# Altium schematic sheet atWork_Main.SchDoc
size A3
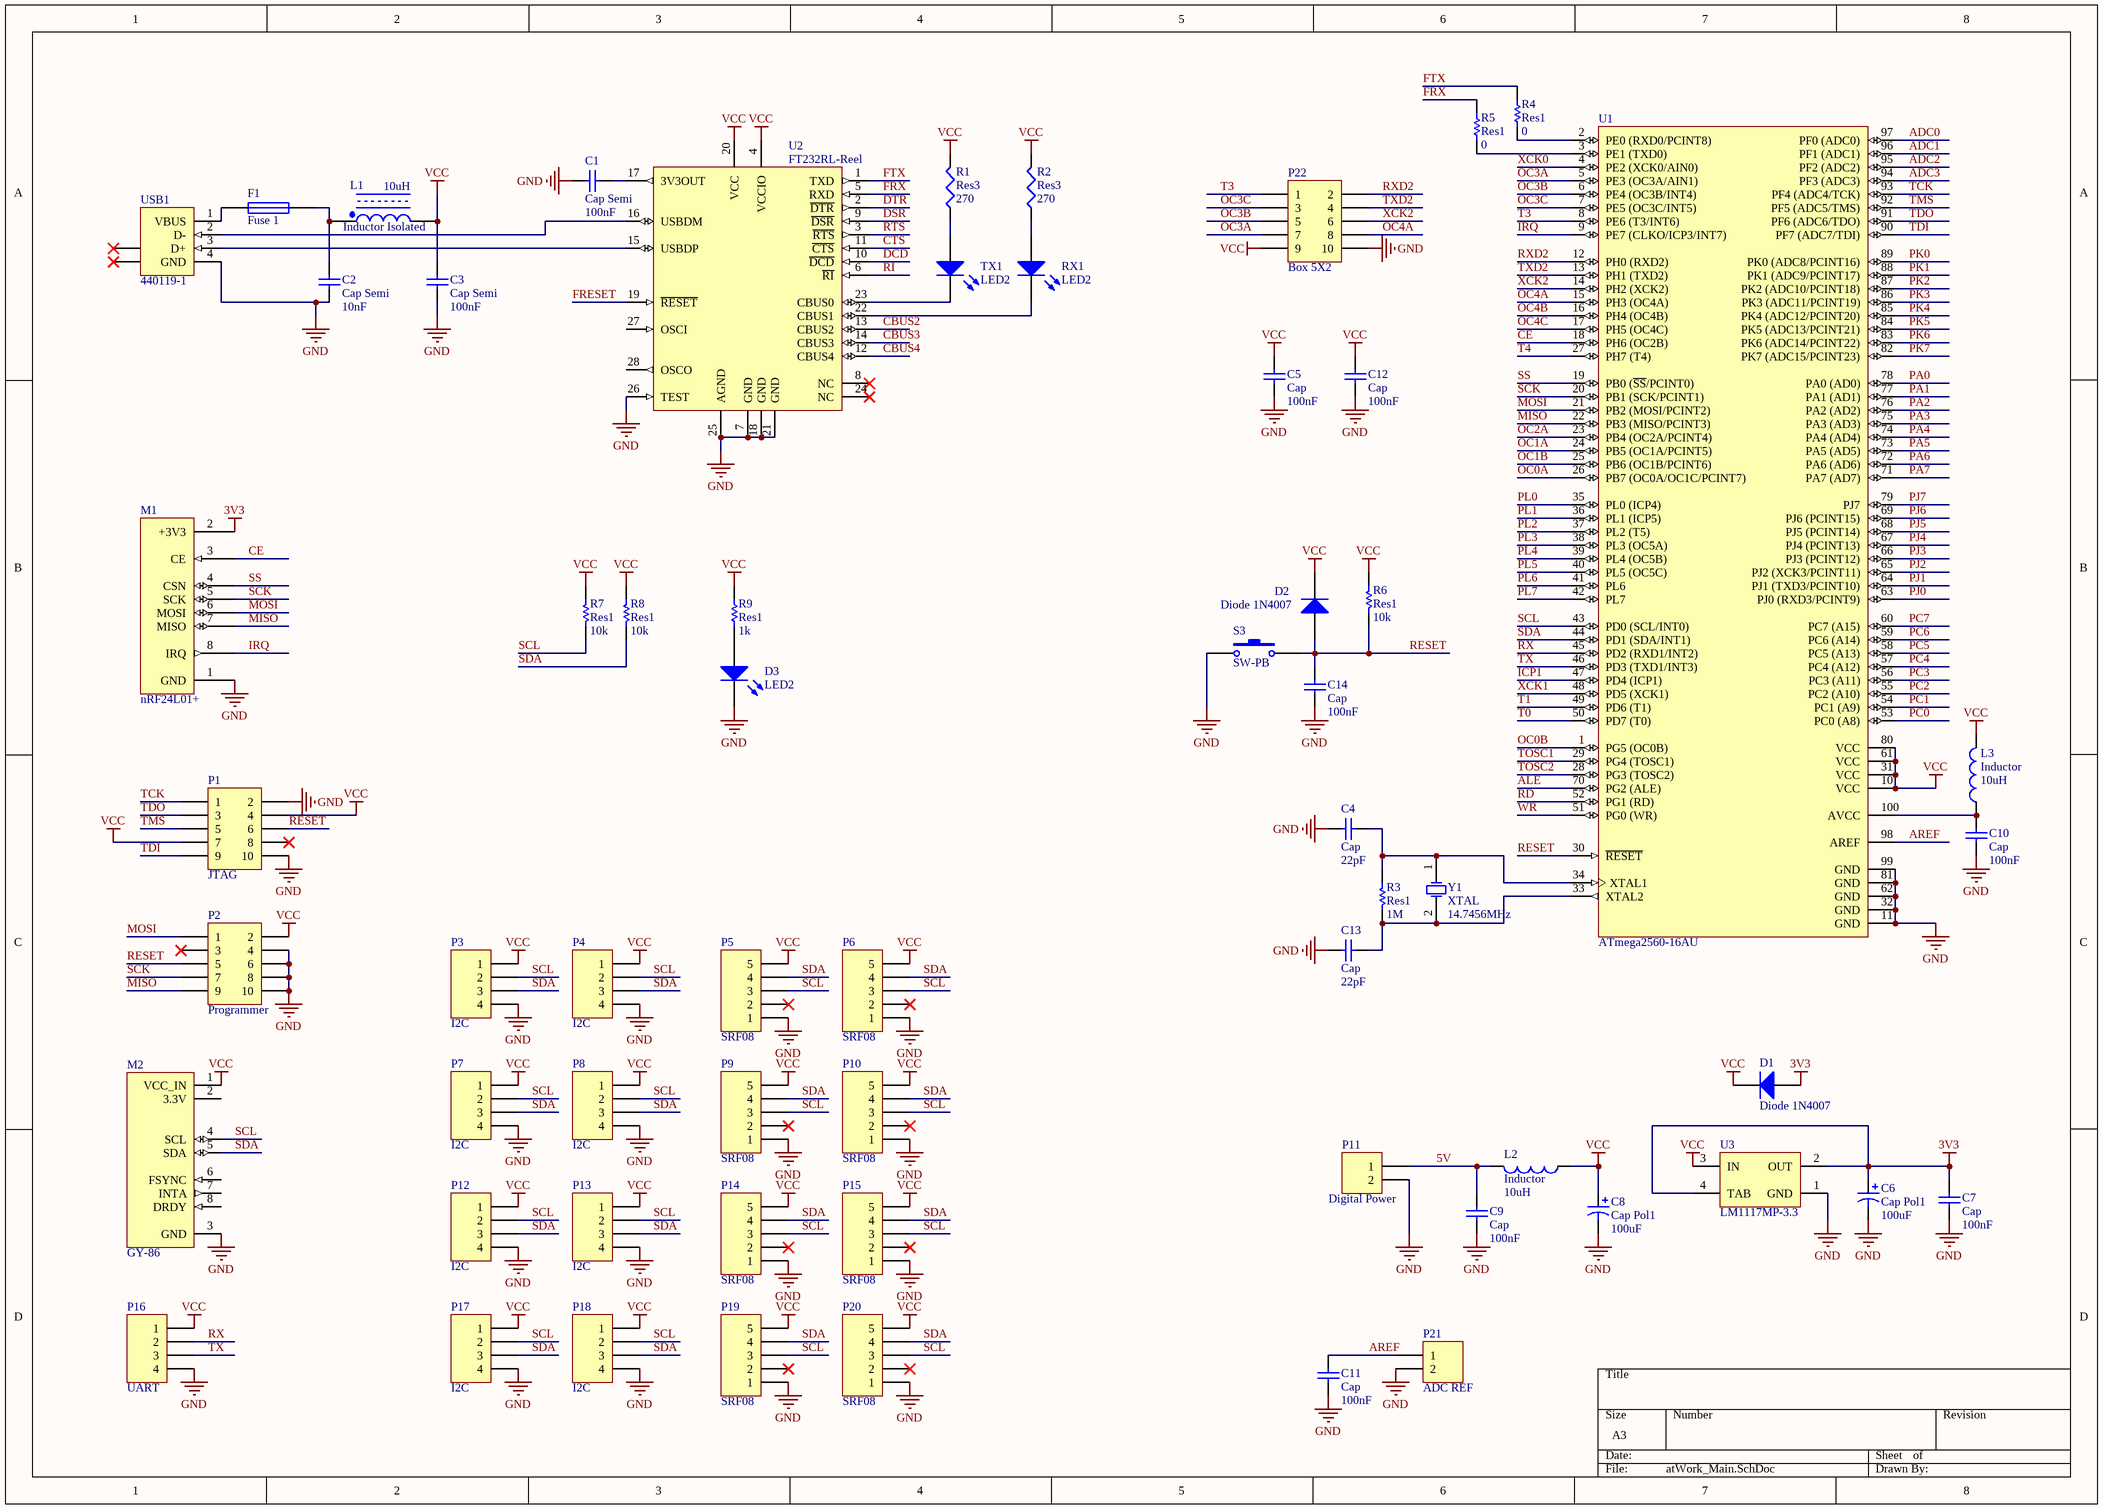
[diagram p0: atWork_Main.SchDoc]

## Parts
C1  Cap Semi  value 100nF  [C1206]
C2  Cap Semi  value 10nF  [C1206]
C3  Cap Semi  value 100nF  [C1206]
C4  Cap  value 22pF  [C1206]
C5  Cap  value 100nF  [C1206]
C6  Cap Pol1  value 100uF  [CAP-SMD1]
C7  Cap  value 100nF  [C1206]
C8  Cap Pol1  value 100uF  [CAP-SMD1]
C9  Cap  value 100nF  [C1206]
C10  Cap  value 100nF  [C1206]
C11  Cap  value 100nF  [C1206]
C12  Cap  value 100nF  [C1206]
C13  Cap  value 22pF  [C1206]
C14  Cap  value 100nF  [C1206]
D1  Diode 1N4007  [DIODE-SMD]
D2  Diode 1N4007  [DIODE-SMD]
D3  LED2  [3.2X1.6X1.1]
F1  Fuse 1  [C1206]
L1  Inductor Isolated  value 10uH  [C1206]
L2  Inductor  value 10uH  [C1206]
L3  Inductor  value 10uH  [C1206]
M1  nRF24L01+  [NRF24L01+]
M2  GY-86  [GY-86]
P1  JTAG  [BOX2X5]
P2  Programmer  [BOX2X5]
P3  I2C  [XH4PIN]
P4  I2C  [XH4PIN]
P5  SRF08  [XH5PIN]
P6  SRF08  [XH5PIN]
P7  I2C  [XH4PIN]
P8  I2C  [XH4PIN]
P9  SRF08  [XH5PIN]
P10  SRF08  [XH5PIN]
P11  Digital Power  [XH2PIN]
P12  I2C  [XH4PIN]
P13  I2C  [XH4PIN]
P14  SRF08  [XH5PIN]
P15  SRF08  [XH5PIN]
P16  UART  [XH4PIN]
P17  I2C  [XH4PIN]
P18  I2C  [XH4PIN]
P19  SRF08  [XH5PIN]
P20  SRF08  [XH5PIN]
P21  ADC REF  [XH2PIN]
P22  Box 5X2  [BOX2X5]
R1  Res3  value 270  [C1206]
R2  Res3  value 270  [C1206]
R3  Res1  value 1M  [C1206]
R4  Res1  value 0  [C1206]
R5  Res1  value 0  [C1206]
R6  Res1  value 10k  [C1206]
R7  Res1  value 10k  [C1206]
R8  Res1  value 10k  [C1206]
R9  Res1  value 1k  [C1206]
RX1  LED2  [3.2X1.6X1.1]
S3  SW-PB  [PUSH1]
TX1  LED2  [3.2X1.6X1.1]
U1  ATmega2560-16AU  [100A_M]
U2  FT232RL-Reel  [SSOP-28_M]
U3  LM1117MP-3.3  [MP04A_M]
USB1  440119-1  [USB-B]
Y1  XTAL  value 14.7456MHz  [XTAL]

## Nets
3V3: C6.1 C7.2 D1.1(A) M1.2(+3V3) U3.2(OUT) U3.4(TAB)
GND: C1.2 C2.1 C3.1 C4.1 C5.1 C6.2 C7.1 C8.2 C9.1 C10.1 C11.1 C12.1 C13.1 C14.1 D3.2(K) M1.1(GND) M2.3(GND) P1.2 P1.10 P2.4 P2.6 P2.8 P2.10 P3.4 P4.4 P5.1 P6.1 P7.4 P8.4 P9.1 P10.1 P11.2 P12.4 P13.4 P14.1 P15.1 P16.4 P17.4 P18.4 P19.1 P20.1 P21.2 P22.10 S3.2 U1.11(GND) U1.32(GND) U1.62(GND) U1.81(GND) U1.99(GND) U2.7(GND) U2.18(GND) U2.21(GND) U2.25(AGND) U2.26(TEST) U3.1(GND) USB1.4(GND)
VCC: C3.2 C5.2 C8.1 C12.2 D1.2(K) D2.2(K) L1.2 L2.2 L3.2 M2.1(VCC_IN) P1.4 P1.7 P2.2 P3.1 P4.1 P5.5 P6.5 P7.1 P8.1 P9.5 P10.5 P12.1 P13.1 P14.5 P15.5 P16.1 P17.1 P18.1 P19.5 P20.5 P22.9 R1.2 R2.2 R6.1 R7.1 R8.1 R9.2 U1.10(VCC) U1.31(VCC) U1.61(VCC) U1.80(VCC) U2.4(VCCIO) U2.20(VCC) U3.3(IN)
5V: C9.2 L2.1 P11.1
ADC0: U1.97(PF0_(ADC0))
ADC1: U1.96(PF1_(ADC1))
ADC2: U1.95(PF2_(ADC2))
ADC3: U1.94(PF3_(ADC3))
ALE: U1.70(PG2_(ALE))
AREF: C11.2 P21.1 U1.98(AREF)
CBUS2: U2.13(CBUS2)
CBUS3: U2.14(CBUS3)
CBUS4: U2.12(CBUS4)
CE: M1.3(CE) U1.18(PH6_(OC2B))
CTS: U2.11(~{CTS})
DCD: U2.10(~{DCD})
DSR: U2.9(~{DSR})
DTR: U2.2(~{DTR})
FRESET: U2.19(~{RESET})
FRX: R5.2 U2.5(RXD)
FTX: R4.1 U2.1(TXD)
ICP1: U1.47(PD4_(ICP1))
IRQ: M1.8(IRQ) U1.9(PE7_(CLKO/ICP3/INT7))
MISO: M1.7(MISO) P2.9 U1.22(PB3_(MISO/PCINT3))
MOSI: M1.6(MOSI) P2.1 U1.21(PB2_(MOSI/PCINT2))
OC0A: U1.26(PB7_(OC0A/OC1C/PCINT7))
OC0B: U1.1(PG5_(OC0B))
OC1A: U1.24(PB5_(OC1A/PCINT5))
OC1B: U1.25(PB6_(OC1B/PCINT6))
OC2A: U1.23(PB4_(OC2A/PCINT4))
OC3A: P22.7 U1.5(PE3_(OC3A/AIN1))
OC3B: P22.5 U1.6(PE4_(OC3B/INT4))
OC3C: P22.3 U1.7(PE5_(OC3C/INT5))
OC4A: P22.8 U1.15(PH3_(OC4A))
OC4B: U1.16(PH4_(OC4B))
OC4C: U1.17(PH5_(OC4C))
PA0: U1.78(PA0_(AD0))
PA1: U1.77(PA1_(AD1))
PA2: U1.76(PA2_(AD2))
PA3: U1.75(PA3_(AD3))
PA4: U1.74(PA4_(AD4))
PA5: U1.73(PA5_(AD5))
PA6: U1.72(PA6_(AD6))
PA7: U1.71(PA7_(AD7))
PC0: U1.53(PC0_(A8))
PC1: U1.54(PC1_(A9))
PC2: U1.55(PC2_(A10))
PC3: U1.56(PC3_(A11))
PC4: U1.57(PC4_(A12))
PC5: U1.58(PC5_(A13))
PC6: U1.59(PC6_(A14))
PC7: U1.60(PC7_(A15))
PJ0: U1.63(PJ0_(RXD3/PCINT9))
PJ1: U1.64(PJ1_(TXD3/PCINT10))
PJ2: U1.65(PJ2_(XCK3/PCINT11))
PJ3: U1.66(PJ3_(PCINT12))
PJ4: U1.67(PJ4_(PCINT13))
PJ5: U1.68(PJ5_(PCINT14))
PJ6: U1.69(PJ6_(PCINT15))
PJ7: U1.79(PJ7)
PK0: U1.89(PK0_(ADC8/PCINT16))
PK1: U1.88(PK1_(ADC9/PCINT17))
PK2: U1.87(PK2_(ADC10/PCINT18))
PK3: U1.86(PK3_(ADC11/PCINT19))
PK4: U1.85(PK4_(ADC12/PCINT20))
PK5: U1.84(PK5_(ADC13/PCINT21))
PK6: U1.83(PK6_(ADC14/PCINT22))
PK7: U1.82(PK7_(ADC15/PCINT23))
PL0: U1.35(PL0_(ICP4))
PL1: U1.36(PL1_(ICP5))
PL2: U1.37(PL2_(T5))
PL3: U1.38(PL3_(OC5A))
PL4: U1.39(PL4_(OC5B))
PL5: U1.40(PL5_(OC5C))
PL6: U1.41(PL6)
PL7: U1.42(PL7)
RD: U1.52(PG1_(RD))
RESET: C14.2 D2.1(A) P1.6 P2.5 R6.2 S3.1 U1.30(~{RESET})
RI: U2.6(~{RI})
RTS: U2.3(~{RTS})
RX: P16.2 U1.45(PD2_(RXD1/INT2))
RXD2: P22.2 U1.12(PH0_(RXD2))
SCK: M1.5(SCK) P2.7 U1.20(PB1_(SCK/PCINT1))
SCL: M2.4(SCL) P3.2 P4.2 P5.3 P6.3 P7.2 P8.2 P9.3 P10.3 P12.2 P13.2 P14.3 P15.3 P17.2 P18.2 P19.3 P20.3 R7.2 U1.43(PD0_(SCL/INT0))
SDA: M2.5(SDA) P3.3 P4.3 P5.4 P6.4 P7.3 P8.3 P9.4 P10.4 P12.3 P13.3 P14.4 P15.4 P17.3 P18.3 P19.4 P20.4 R8.2 U1.44(PD1_(SDA/INT1))
SS: M1.4(CSN) U1.19(PB0_(~{SS}/PCINT0))
T0: U1.50(PD7_(T0))
T1: U1.49(PD6_(T1))
T3: P22.1 U1.8(PE6_(T3/INT6))
T4: U1.27(PH7_(T4))
TCK: P1.1 U1.93(PF4_(ADC4/TCK))
TDI: P1.9 U1.90(PF7_(ADC7/TDI))
TDO: P1.3 U1.91(PF6_(ADC6/TDO))
TMS: P1.5 U1.92(PF5_(ADC5/TMS))
TOSC1: U1.29(PG4_(TOSC1))
TOSC2: U1.28(PG3_(TOSC2))
TX: P16.3 U1.46(PD3_(TXD1/INT3))
TXD2: P22.4 U1.13(PH1_(TXD2))
WR: U1.51(PG0_(WR))
XCK0: U1.4(PE2_(XCK0/AIN0))
XCK1: U1.48(PD5_(XCK1))
XCK2: P22.6 U1.14(PH2_(XCK2))
NetC1_1: C1.1 U2.17(3V3OUT)
NetC2_2: C2.2 F1.2 L1.1
NetC4_2: C4.2 R3.1 U1.34(XTAL1) Y1.1(OSC1)
NetC10_2: C10.2 L3.1 U1.100(AVCC)
NetC13_2: C13.2 R3.2 U1.33(XTAL2) Y1.2(OSC2)
NetD3_1: D3.1(A) R9.1
NetF1_1: F1.1 USB1.1(VBUS)
NetR1_1: R1.1 TX1.1(A)
NetR2_1: R2.1 RX1.1(A)
NetR4_2: R4.2 U1.2(PE0_(RXD0/PCINT8))
NetR5_1: R5.1 U1.3(PE1_(TXD0))
NetRX1_2: RX1.2(K) U2.22(CBUS1)
NetTX1_2: TX1.2(K) U2.23(CBUS0)
NetU2_15: U2.15(USBDP) USB1.3(D+)
NetU2_16: U2.16(USBDM) USB1.2(D-)

Not connected (* = marked no-connect by the designer): M2 2(3.3V) 6(FSYNC) 7(INTA) 8(DRDY); P1 8*; P2 3*; P5 2*; P6 2*; P9 2*; P10 2*; P14 2*; P15 2*; P19 2*; P20 2*; U2 8(NC)* 24(NC)* 27(OSCI) 28(OSCO); USB1 5(SHLD)* 6(SHLD)*

## Library data of the parts
C1-C3 = Cap Semi: Capacitor (Semiconductor SIM Model); Published: 8-Jun-2000; LatestRevisionDate: 29-May-2009; LatestRevisionNote: IPC-7351 Footprint Added.; PackageReference: C1206; Publisher: Altium Limited; PackageDescription: Chip Capacitor
C4 C5 C7 C9-C14 = Cap: Capacitor; Published: 8-Jun-2000; LatestRevisionDate: 17-Jul-2002; LatestRevisionNote: Re-released for DXP Platform.; PackageReference: RAD-0.3; Publisher: Altium Limited; PackageDescription: Radial Cap, Thru-Hole; 2 Leads; 0.3 in Pin Spacing
C6 C8 = Cap Pol1: Polarized Capacitor (Radial); Published: 8-Jun-2000; LatestRevisionDate: 17-Jul-2002; LatestRevisionNote: Re-released for DXP Platform.; PackageReference: RB7.6-15; Publisher: Altium Limited; PackageDescription: Polarized Capacitor (Radial); 2 Leads
D1 D2 = Diode 1N4007: 1 Amp General Purpose Rectifier; Published: 8-Jun-2000; LatestRevisionDate: 17-Jul-2002; LatestRevisionNote: Re-released for DXP Platform.; DatasheetVersion: 1998; PackageVersion: Aug-1999; PackageReference: DO-41; Publisher: Altium Limited; PackageDescription: Diode, Axial; Body 5.2 x 2.7 mm (LxDia. max), Lead Dia. 0.86 mm (max); Code_JEDEC: DO-204-AL; ComponentLink1Description: Manufacturer Link; ComponentLink1URL: http://www.fairchildsemi.com/; ComponentLink2Description: Datasheet; ComponentLink2URL: http://www.fairchildsemi.com/ds/1N%2F1N4001.pdf
D3 RX1 TX1 = LED2: Typical RED, GREEN, YELLOW, AMBER GaAs LED; Published: 8-Jun-2000; LatestRevisionDate: 17-Jul-2002; LatestRevisionNote: Re-released for DXP Platform.; PackageVersion: Feb-2002; PackageReference: 3.2X1.6X1.1; Publisher: Altium Limited; PackageDescription: SM LED; 2 Flat Leads
F1 = Fuse 1: Fuse; Published: 8-Jun-2000; LatestRevisionDate: 17-Jul-2002; LatestRevisionNote: Re-released for DXP Platform.; PackageReference: PIN-W2/E2.8; Publisher: Altium Limited; PackageDescription: Thru-Hole; 2 Leads
L1 = Inductor Isolated: Isolated Inductor; Published: 24-Mar-1999; LatestRevisionDate: 17-Jul-2002; LatestRevisionNote: Re-released for DXP Platform.; PackageVersion: 1988; PackageReference: 425; Publisher: Altium Limited; PackageDescription: SOD-123; 2 Leads; Body 2.7 x 1.6 mm, (LxW)
L2 L3 = Inductor: Code_IEC: 1005; Published: 8-Jun-2000; LatestRevisionDate: 29-May-2009; LatestRevisionNote: IPC-7351 Footprint Added.; PackageReference: 0402-A; Publisher: Altium Limited; PackageDescription: Chip Inductor; Code_JEITA: 0402
M1 = nRF24L01+: nRF24L01 Single Chip 2.4GHz Tranceiver, +PA +LNA Ver5.1; Designer: Meysam Parvizi; Email: meysam.parvizi.ir@gmail.com; Weblog: http://mp.tabin.ir
M2 = GY-86: GY-86 IMU (10DOF MS5611 HMC5883L MPU6050); Designer: Meysam Parvizi; Email: meysam.parvizi.ir@gmail.com; Weblog: http://mp.tabin.ir
P1 P2 P22 = Box 5X2: Box, 5-Pin, Dual row; Designer: Meysam Parvizi; Email: meysam.parvizi.ir@gmail.com; Weblog: http://mp.tabin.ir
P3 P4 P7 P8 P12 P13 P16-P18 = Header 4: Header, 4-Pin; LatestRevisionDate: 17-Jul-2002; LatestRevisionNote: Re-released for DXP Platform.; Publisher: Altium Limited
P5 P6 P9 P10 P14 P15 P19 P20 = Header 5: LatestRevisionDate: 17-Jul-2002; LatestRevisionNote: Re-released for DXP Platform.; Publisher: Altium Limited
P11 P21 = Header 2: Header, 2-Pin; LatestRevisionDate: 17-Jul-2002; LatestRevisionNote: Re-released for DXP Platform.; Publisher: Altium Limited
R1 R2 = Res3: Resistor; Published: 8-Jun-2000; LatestRevisionDate: 29-May-2009; LatestRevisionNote: IPC-7351 Footprint Added.; PackageReference: J1-0603; Publisher: Altium Limited; PackageDescription: Chip Resistor
R3-R9 = Res1: Resistor; Published: 8-Jun-2000; LatestRevisionDate: 17-Jul-2002; LatestRevisionNote: Re-released for DXP Platform.; PackageReference: AXIAL-0.3; Publisher: Altium Limited; PackageDescription: Axial Device, Thru-Hole; 2 Leads; 0.3 in Pin Spacing
S3 = SW-PB: Switch; Published: 24-Mar-1999; LatestRevisionDate: 17-Jul-2002; LatestRevisionNote: Re-released for DXP Platform.; PackageReference: SPST-2; Publisher: Altium Limited; PackageDescription: Switch; 2 Leads
U1 = ATmega2560-16AU: 8-bit AVR Microcontroller, 4.5-5.5V, 256KB Flash, 4KB EEPROM, 8KB SRAM, 86 GPIO pins, 100-pin TQFP, Industrial Grade (-40°C to 85°C), Pb-Free; Published: 1-Apr-2010; DatasheetVersion: revL, Aug-2007; PackageVersion: revC, Oct-2001; PackageReference: 100A; Publisher: Altium Limited; PackageDescription: 100-Pin Thin Profile Plastic Quad Flat Pack (TQFP), 14 x 14 x 1.0 mm Body, 0.5 mm Pitch; Supplier 1: Digi-Key; Supplier Part Number 1: ATMEGA2560-16AU-ND; Supplier 2: Farnell; Supplier Part Number 2: 1288330; Supplier 3: Farnell; Supplier Part Number 3: 1661740; Supplier 4: Mouser; Supplier Part Number 4: 556-ATMEGA2560-16AU; Code_JEDEC: MS-026-AED; ComponentLink1Description: Manufacturer Link; ComponentLink1URL: http://www.atmel.com/products/avr/default.asp?; ComponentLink2Description: ATmega640/1280/1281/2560/2561 Datasheet; ComponentLink2URL: http://www.atmel.com/dyn/resources/prod_documents/doc2549.pdf; ComponentLink3Description: ATmega640/1280/1281/2560/2561 Summary; ComponentLink3URL: http://www.atmel.com/dyn/resources/prod_documents/2549S.pdf; ComponentLink4Description: Atmel.com Home; ComponentLink4URL: http://www.atmel.com
U2 = FT232RL-Reel: USB UART Asynchronous Serial Data Transfer Chip, 28-pin SSOP, Tape and Reel; Manufacturer: FTDI; DatasheetVersion: ver 2.10, Mar-2012; PackageVersion: Mar-12; PackageReference: SSOP-28; PackageDescription: 28-Pin Small Outline Package 0.65 mm Pitch; PartNumber: FT232RL-Reel; ComponentLink1Description: Manufacturer URL; ComponentLink1URL: http://www.ftdichip.com/; ComponentLink2Description: Datasheet; ComponentLink2URL: http://www.ftdichip.com/Support/Documents/DataSheets/ICs/DS_FT232R.pdf
U3 = LM1117MP-3.3: 800mA Low-Dropout Linear Regulator, 4-pin SOT-223; Manufacturer: National Semiconductor; PackageTopMarking: XYTT*N05A; PowerWise: N; CompType: LDO IC; Published: 4-Dec-2008; DatasheetVersion: Apr-2006; PackageVersion: revB, Apr-2003; PackageReference: MP04A; Publisher: Altium Limited; PackageDescription: Molded SOT-223, 6.50 x 3.56 x 1.6mm Body, 4 Lead, 2.3mm Pitch; Supplier 1: Farnell; Supplier Part Number 1: 9778195; Supplier 2: Farnell; Supplier Part Number 2: 9778195RL; PartNumber: LM1117MP-3.3; RoHS: N; PinCount: 4; Code_JEDEC: TO-261-AA; Code_IPC: SOT223-4; ComponentLink1Description: LM1117 Datasheet; ComponentLink1URL: http://www.national.com/ds/LM/LM1117.pdf; ComponentLink2Description: LM1117 Web Page; ComponentLink2URL: http://www.national.com/pf/LM/LM1117.html; ComponentLink3Description: MP04A Package Page; ComponentLink3URL: http://www.national.com/packaging/folders/mp04a.html
USB1 = 440119-1: USB 1.1, Right Angle, Thru-Hole, B Type, Receptacle, 4 Position, Beige; ContactMaterial: Copper Alloy; ContactPlating: Gold Flash over Nickel; TerminationLength: 2.84mm [0.112in.]; PCB_Layout: Complies with manufacturer's recommendation.; DrillSize: Corresponds to nominal value.; PanelGround: Without; Published: 15-Jul-2004; DatasheetDocument: 12-Jan-2004; PackageDocument: 12-Jan-2004; PackageReference: 440119; Publisher: Altium Limited; HousingMaterial: Thermoplastic; ComponentLink1Description: Manufacturer Link; ComponentLink1URL: http://www.tycoelectronics.com/; ComponentLink2Description: Packaging Specification; ComponentLink2URL: http://ecommas.tycoelectronics.com/commerce/DocumentDelivery/DDEController?Action=showdoc&DocId=Customer+Drawing%7F440119%7FC%7Ftif%7FEnglish%7FC_440119_C.tif
Y1 = XTAL: Crystal Oscillator; Designer: Meysam Parvizi; Email: meysam.parvizi.ir@gmail.com; Weblog: http://mp.tabin.ir